# EAGLE board OutputIndicator_v1p2 (EAGLE 9.6.1)
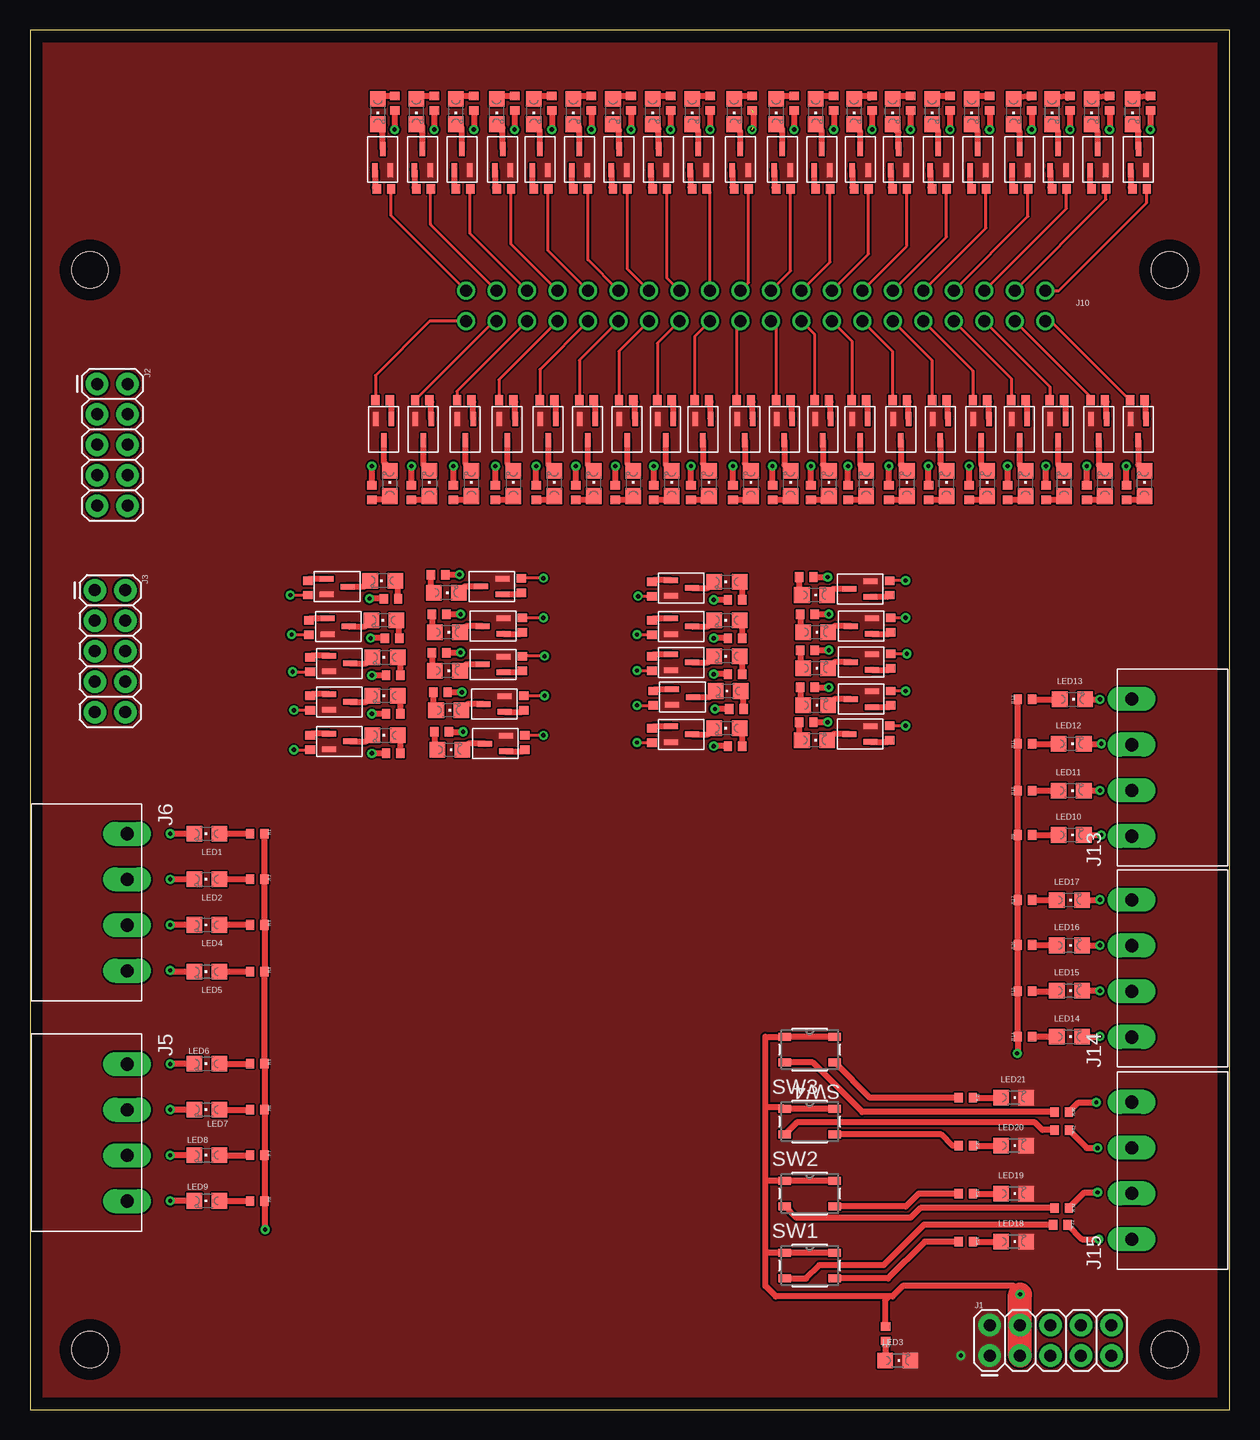
[diagram p6: board, top side]
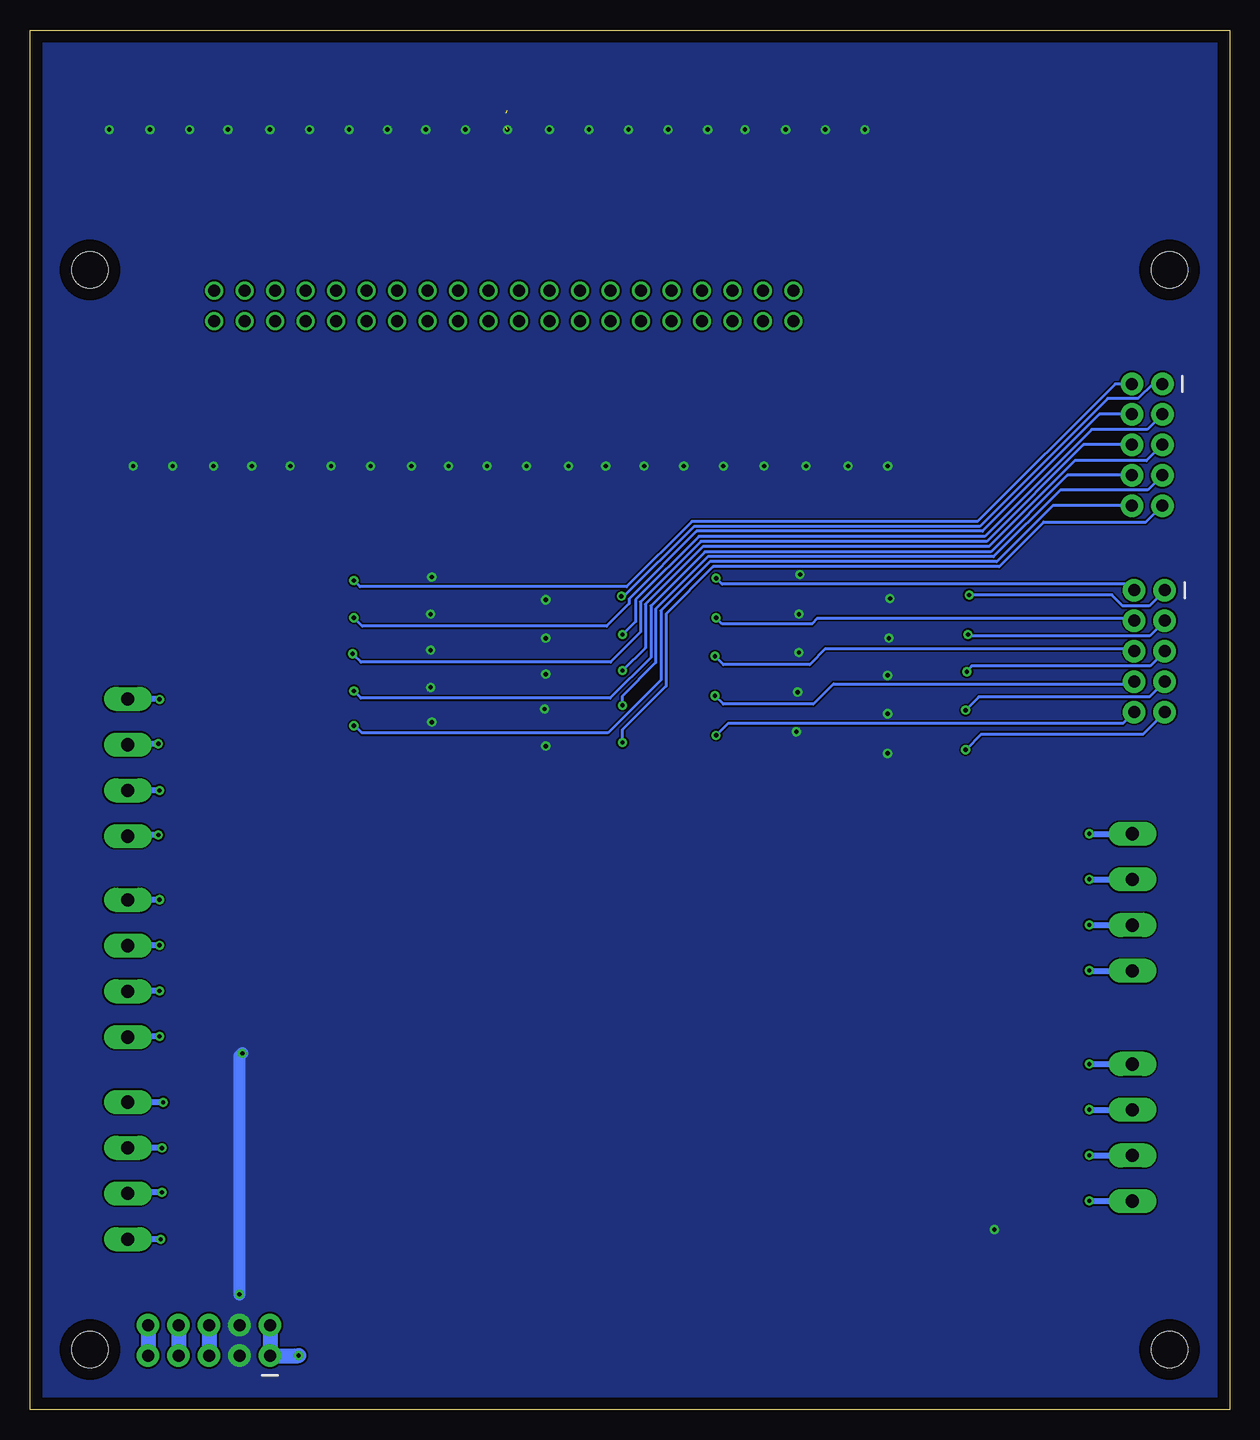
[diagram p7: board, bottom side, seen from below]

Size 100 x 115 mm. Coordinates in mm from the lower left corner, seen from the top.
Outline: 0,0 100,0 100,115 0,115 0,0
Copper layers (1*16): Top 0.035mm / dielectric 1.5mm / Bottom 0.035mm
Design rules "default": minimum track width 6mil, minimum drill 0.35mm, track to track 6mil, track to pad 6mil, pad to pad 6mil, via to via 6mil, smd to smd 6mil, copper to edge 40mil, drill to drill 6mil, minimum pad ring 10mil, minimum via ring 8mil, stop-mask expansion 4mil, vias tented up to drill 0mil, thermal gap 10mil
Holes 3 mm at 5,5 95,5 5,95 95,95

## Footprints (pad centres in the part's own frame; a part is rotated, then mirrored left to right if it is on the bottom)
2X5 = drill 1 pad 1.88: 1 0,0; 2 0,2.54; 3 2.54,0; 4 2.54,2.54; 5 5.08,0; 6 5.08,2.54; 7 7.62,0; 8 7.62,2.54; 9 10.16,0; 10 10.16,2.54
1X4_3.81MM_PITCH = drill 1.1 pad 2 long: P$1 0,0; P$2 3.81,0; P$3 7.62,0; P$4 11.43,0
HEADER_2_X_20_.1_INCH = drill 1: P$1 -24.13,-1.27; P$2 -24.13,1.27; P$3 -21.59,-1.27; P$4 -21.59,1.27; P$5 -19.05,-1.27; P$6 -19.05,1.27; P$7 -16.51,-1.27; P$8 -16.51,1.27; P$9 -13.97,-1.27; P$10 -13.97,1.27; P$11 -11.43,-1.27; P$12 -11.43,1.27; P$13 -8.89,-1.27; P$14 -8.89,1.27; P$15 -6.35,-1.27; P$16 -6.35,1.27; P$17 -3.81,-1.27; P$18 -3.81,1.27; P$19 -1.27,-1.27; P$20 -1.27,1.27; P$21 1.27,-1.27; P$22 1.27,1.27; P$23 3.81,-1.27; P$24 3.81,1.27; P$25 6.35,-1.27; P$26 6.35,1.27; P$27 8.89,-1.27; P$28 8.89,1.27; P$29 11.43,-1.27; P$30 11.43,1.27; P$31 13.97,-1.27; P$32 13.97,1.27; P$33 16.51,-1.27; P$34 16.51,1.27; P$35 19.05,-1.27; P$36 19.05,1.27; P$37 21.59,-1.27; P$38 21.59,1.27; P$39 24.13,-1.27; P$40 24.13,1.27
LED_0805_GREEN = smd 1.3 x 1.3: A 0,-1.05; C 0,1.05
0402 = smd 0.8 x 0.7: P$1 0,0.6; P$2 0,-0.6
PTS810 = smd 1.041 x 0.66: 1 -2.075,1.075; 2 2.075,1.075; 3 -2.075,-1.075; 4 2.075,-1.075
SOT323 = smd 0.457 x 1.168: 1 -0.65,-0.876; 2 0.65,-0.876; 3 0,0.876

## Placement (x,y rotation side)
J1  [2X5]  80,4.5 0 top
J2  [2X5]  5.6,85.5 270 top
J3  [2X5]  5.4,68.3 270 top
J5  [1X4_3.81MM_PITCH]  8.1,28.8 270 top
J6  [1X4_3.81MM_PITCH]  8.1,48 270 top
J10  [HEADER_2_X_20_.1_INCH]  60.5,92 0 top
J13  [1X4_3.81MM_PITCH]  91.85,47.8 90 top
J14  [1X4_3.81MM_PITCH]  91.85,31.05 90 top
J15  [1X4_3.81MM_PITCH]  91.85,14.2 90 top
LED1  LED_0805_GREEN  [LED_0805_GREEN]  14.75,48 90 top
LED2  LED_0805_GREEN  [LED_0805_GREEN]  14.75,44.2 90 top
LED3  LED_0805_GREEN  [LED_0805_GREEN]  72.34,4.09 270 top
LED4  LED_0805_GREEN  [LED_0805_GREEN]  14.75,40.4 90 top
LED5  LED_0805_GREEN  [LED_0805_GREEN]  14.75,36.5 90 top
LED6  LED_0805_GREEN  [LED_0805_GREEN]  14.75,28.82 90 top
LED7  LED_0805_GREEN  [LED_0805_GREEN]  14.75,25 90 top
LED8  LED_0805_GREEN  [LED_0805_GREEN]  14.75,21.2 90 top
LED9  LED_0805_GREEN  [LED_0805_GREEN]  14.75,17.4 90 top
LED10  LED_0805_GREEN  [LED_0805_GREEN]  86.8,47.9 270 top
LED11  LED_0805_GREEN  [LED_0805_GREEN]  86.8,51.6 270 top
LED12  LED_0805_GREEN  [LED_0805_GREEN]  86.8,55.5 270 top
LED13  LED_0805_GREEN  [LED_0805_GREEN]  86.9,59.2 270 top
LED14  LED_0805_GREEN  [LED_0805_GREEN]  86.66,31.07 270 top
LED15  LED_0805_GREEN  [LED_0805_GREEN]  86.66,34.92 270 top
LED16  LED_0805_GREEN  [LED_0805_GREEN]  86.66,38.69 270 top
LED17  LED_0805_GREEN  [LED_0805_GREEN]  86.66,42.47 270 top
LED18  LED_0805_GREEN  [LED_0805_GREEN]  82,14 270 top
LED19  LED_0805_GREEN  [LED_0805_GREEN]  82,18 270 top
LED20  LED_0805_GREEN  [LED_0805_GREEN]  82,22 270 top
LED21  LED_0805_GREEN  [LED_0805_GREEN]  82,26 270 top
LED23  LED_0805_GREEN  [LED_0805_GREEN]  29,108.2 180 top
LED24  LED_0805_GREEN  [LED_0805_GREEN]  32.2,108.2 180 top
LED25  LED_0805_GREEN  [LED_0805_GREEN]  35.5,108.2 180 top
LED26  LED_0805_GREEN  [LED_0805_GREEN]  29.4,69.1 90 top
LED27  LED_0805_GREEN  [LED_0805_GREEN]  38.9,108.2 180 top
LED28  LED_0805_GREEN  [LED_0805_GREEN]  29.5,65.8 90 top
LED29  LED_0805_GREEN  [LED_0805_GREEN]  42,108.2 180 top
LED30  LED_0805_GREEN  [LED_0805_GREEN]  34.7,68.1 270 top
LED31  LED_0805_GREEN  [LED_0805_GREEN]  45.3,108.2 180 top
LED32  LED_0805_GREEN  [LED_0805_GREEN]  29.6,62.7 90 top
LED33  LED_0805_GREEN  [LED_0805_GREEN]  48.6,108.2 180 top
LED35  LED_0805_GREEN  [LED_0805_GREEN]  51.9,108.2 180 top
LED36  LED_0805_GREEN  [LED_0805_GREEN]  29.6,56.2 90 top
LED37  LED_0805_GREEN  [LED_0805_GREEN]  55.2,108.2 180 top
LED38  LED_0805_GREEN  [LED_0805_GREEN]  34.8,64.8 270 top
LED39  LED_0805_GREEN  [LED_0805_GREEN]  58.7,108.2 180 top
LED40  LED_0805_GREEN  [LED_0805_GREEN]  29.6,59.5 90 top
LED41  LED_0805_GREEN  [LED_0805_GREEN]  62.2,108.2 180 top
LED43  LED_0805_GREEN  [LED_0805_GREEN]  65.5,108.2 180 top
LED44  LED_0805_GREEN  [LED_0805_GREEN]  34.8,61.6 270 top
LED45  LED_0805_GREEN  [LED_0805_GREEN]  68.7,108.2 180 top
LED47  LED_0805_GREEN  [LED_0805_GREEN]  71.9,108.2 180 top
LED48  LED_0805_GREEN  [LED_0805_GREEN]  34.9,58.3 270 top
LED49  LED_0805_GREEN  [LED_0805_GREEN]  75.2,108.2 180 top
LED51  LED_0805_GREEN  [LED_0805_GREEN]  78.5,108.2 180 top
LED52  LED_0805_GREEN  [LED_0805_GREEN]  35,55 270 top
LED53  LED_0805_GREEN  [LED_0805_GREEN]  82,108.2 180 top
LED55  LED_0805_GREEN  [LED_0805_GREEN]  85.2,108.2 180 top
LED56  LED_0805_GREEN  [LED_0805_GREEN]  58.1,69 90 top
LED57  LED_0805_GREEN  [LED_0805_GREEN]  88.5,108.2 180 top
LED59  LED_0805_GREEN  [LED_0805_GREEN]  91.9,108.2 180 top
LED60  LED_0805_GREEN  [LED_0805_GREEN]  58.1,65.8 90 top
LED61  LED_0805_GREEN  [LED_0805_GREEN]  30,77.2 0 top
LED63  LED_0805_GREEN  [LED_0805_GREEN]  33.3,77.2 0 top
LED64  LED_0805_GREEN  [LED_0805_GREEN]  58.1,62.8 90 top
LED65  LED_0805_GREEN  [LED_0805_GREEN]  36.8,77.2 0 top
LED67  LED_0805_GREEN  [LED_0805_GREEN]  40.3,77.2 0 top
LED68  LED_0805_GREEN  [LED_0805_GREEN]  58.2,59.9 90 top
LED69  LED_0805_GREEN  [LED_0805_GREEN]  43.7,77.2 0 top
LED71  LED_0805_GREEN  [LED_0805_GREEN]  47,77.2 0 top
LED72  LED_0805_GREEN  [LED_0805_GREEN]  58.1,56.8 90 top
LED73  LED_0805_GREEN  [LED_0805_GREEN]  50.3,77.2 0 top
LED75  LED_0805_GREEN  [LED_0805_GREEN]  53.5,77.2 0 top
LED76  LED_0805_GREEN  [LED_0805_GREEN]  65.4,67.9 270 top
LED77  LED_0805_GREEN  [LED_0805_GREEN]  56.6,77.2 0 top
LED79  LED_0805_GREEN  [LED_0805_GREEN]  60.1,77.2 0 top
LED80  LED_0805_GREEN  [LED_0805_GREEN]  65.5,64.8 270 top
LED81  LED_0805_GREEN  [LED_0805_GREEN]  63.4,77.2 0 top
LED83  LED_0805_GREEN  [LED_0805_GREEN]  66.6,77.2 0 top
LED84  LED_0805_GREEN  [LED_0805_GREEN]  65.5,61.8 270 top
LED85  LED_0805_GREEN  [LED_0805_GREEN]  69.7,77.2 0 top
LED87  LED_0805_GREEN  [LED_0805_GREEN]  73.1,77.2 0 top
LED88  LED_0805_GREEN  [LED_0805_GREEN]  65.5,58.7 270 top
LED89  LED_0805_GREEN  [LED_0805_GREEN]  76.4,77.2 0 top
LED91  LED_0805_GREEN  [LED_0805_GREEN]  79.8,77.2 0 top
LED92  LED_0805_GREEN  [LED_0805_GREEN]  65.4,55.8 270 top
LED93  LED_0805_GREEN  [LED_0805_GREEN]  83,77.2 0 top
LED95  LED_0805_GREEN  [LED_0805_GREEN]  86.2,77.2 0 top
LED97  LED_0805_GREEN  [LED_0805_GREEN]  89.6,77.2 0 top
LED99  LED_0805_GREEN  [LED_0805_GREEN]  92.9,77.2 0 top
R1  470R  [0402]  18.95,48 270 top
R2  470R  [0402]  18.95,44.2 270 top
R3  470R  [0402]  18.95,40.4 270 top
R4  470R  [0402]  18.95,36.5 270 top
R5  470R  [0402]  18.95,28.83 270 top
R6  470R  [0402]  18.95,25 270 top
R7  470R  [0402]  18.95,21.2 270 top
R8  470R  [0402]  18.95,17.38 270 top
R9  470R  [0402]  82.95,47.9 90 top
R10  470R  [0402]  82.95,51.6 90 top
R11  470R  [0402]  82.95,55.5 90 top
R12  470R  [0402]  82.95,59.2 90 top
R13  470R  [0402]  71.32,6.33 180 top
R14  470R  [0402]  82.95,31.1 90 top
R15  470R  [0402]  82.95,34.86 90 top
R16  470R  [0402]  82.95,38.73 90 top
R17  470R  [0402]  82.95,42.48 90 top
R18  470R  [0402]  78,14 270 top
R19  470R  [0402]  78,18 270 top
R20  470R  [0402]  78,22 270 top
R21  470R  [0402]  78,26 270 top
R22  470  [0402]  85.9,15.4 270 top
R23  470R  [0402]  30.4,108.9 0 top
R24  470R  [0402]  33.7,108.9 0 top
R25  470R  [0402]  37,108.9 0 top
R26  470R  [0402]  30.09,67.6 270 top
R27  470R  [0402]  40.4,108.9 0 top
R28  470R  [0402]  30.19,64.3 270 top
R29  470R  [0402]  43.5,108.9 0 top
R30  470R  [0402]  34.01,69.6 90 top
R31  470R  [0402]  46.8,108.9 0 top
R32  470R  [0402]  30.29,61.2 270 top
R33  470R  [0402]  50.1,108.9 0 top
R34  470  [0402]  86,16.8 270 top
R35  470R  [0402]  53.4,108.9 0 top
R36  470R  [0402]  30.29,54.7 270 top
R37  470R  [0402]  56.7,108.9 0 top
R38  470R  [0402]  34.11,66.3 90 top
R39  470R  [0402]  60.2,108.9 0 top
R40  470R  [0402]  30.29,58 270 top
R41  470R  [0402]  63.7,108.9 0 top
R42  470  [0402]  86,23.3 270 top
R43  470R  [0402]  67,108.9 0 top
R44  470R  [0402]  34.11,63.1 90 top
R45  470R  [0402]  70.2,108.9 0 top
R46  470  [0402]  86,24.8 270 top
R47  470R  [0402]  73.4,108.9 0 top
R48  470R  [0402]  34.21,59.8 90 top
R49  470R  [0402]  76.7,108.89 0 top
R51  470R  [0402]  80,108.9 0 top
R52  470R  [0402]  34.31,56.5 90 top
R53  470R  [0402]  83.5,108.9 0 top
R55  470R  [0402]  86.7,108.9 0 top
R56  470R  [0402]  58.79,67.5 270 top
R57  470R  [0402]  90,108.9 0 top
R59  470R  [0402]  93.4,108.9 0 top
R60  470R  [0402]  58.79,64.3 270 top
R61  470R  [0402]  28.5,76.45 180 top
R63  470R  [0402]  31.8,76.45 180 top
R64  470R  [0402]  58.79,61.3 270 top
R65  470R  [0402]  35.3,76.45 180 top
R67  470R  [0402]  38.8,76.45 180 top
R68  470R  [0402]  58.89,58.4 270 top
R69  470R  [0402]  42.2,76.45 180 top
R71  470R  [0402]  45.5,76.45 180 top
R72  470R  [0402]  58.79,55.3 270 top
R73  470R  [0402]  48.8,76.45 180 top
R75  470R  [0402]  52,76.45 180 top
R76  470R  [0402]  64.71,69.4 90 top
R77  470R  [0402]  55.1,76.45 180 top
R79  470R  [0402]  58.6,76.45 180 top
R80  470R  [0402]  64.81,66.3 90 top
R81  470R  [0402]  61.9,76.45 180 top
R83  470R  [0402]  65.1,76.45 180 top
R84  470R  [0402]  64.81,63.3 90 top
R85  470R  [0402]  68.2,76.45 180 top
R87  470R  [0402]  71.6,76.45 180 top
R88  470R  [0402]  64.81,60.2 90 top
R89  470R  [0402]  74.9,76.45 180 top
R91  470R  [0402]  78.3,76.45 180 top
R92  470R  [0402]  64.71,57.3 90 top
R93  470R  [0402]  81.5,76.45 180 top
R95  470R  [0402]  84.7,76.45 180 top
R97  470R  [0402]  88.1,76.45 180 top
R99  470R  [0402]  91.4,76.45 180 top
RYS1  1K  [0402]  29.5,101.75 270 top
RYS2  1K  [0402]  32.8,101.75 270 top
RYS3  1K  [0402]  36.1,101.75 270 top
RYS4  1K  [0402]  23.15,68.5 180 top
RYS5  1K  [0402]  39.5,101.75 270 top
RYS6  1K  [0402]  23.25,65.2 180 top
RYS7  1K  [0402]  42.6,101.75 270 top
RYS9  1K  [0402]  40.95,68.7 0 top
RYS10  1K  [0402]  45.9,101.75 270 top
RYS11  1K  [0402]  23.35,62.1 180 top
RYS12  1K  [0402]  49.2,101.75 270 top
RYS14  1K  [0402]  52.5,101.75 270 top
RYS15  1K  [0402]  23.35,55.6 180 top
RYS16  1K  [0402]  55.8,101.75 270 top
RYS17  1K  [0402]  41.05,65.4 0 top
RYS18  1K  [0402]  59.3,101.75 270 top
RYS19  1K  [0402]  23.35,58.9 180 top
RYS20  1K  [0402]  62.8,101.75 270 top
RYS22  1K  [0402]  66.1,101.75 270 top
RYS23  1K  [0402]  41.05,62.2 0 top
RYS24  1K  [0402]  69.3,101.75 270 top
RYS26  1K  [0402]  72.5,101.75 270 top
RYS27  1K  [0402]  41.15,58.9 0 top
RYS28  1K  [0402]  75.8,101.75 270 top
RYS30  1K  [0402]  79.1,101.75 270 top
RYS31  1K  [0402]  41.25,55.6 0 top
RYS32  1K  [0402]  82.6,101.75 270 top
RYS34  1K  [0402]  85.8,101.75 270 top
RYS35  1K  [0402]  51.85,68.4 180 top
RYS36  1K  [0402]  89.1,101.75 270 top
RYS38  1K  [0402]  92.5,101.75 270 top
RYS39  1K  [0402]  51.85,65.2 180 top
RYS40  1K  [0402]  29.4,84.15 90 top
RYS42  1K  [0402]  32.7,84.15 90 top
RYS43  1K  [0402]  51.85,62.2 180 top
RYS44  1K  [0402]  36.2,84.15 90 top
RYS46  1K  [0402]  39.7,84.15 90 top
RYS47  1K  [0402]  51.95,59.3 180 top
RYS48  1K  [0402]  43.1,84.15 90 top
RYS50  1K  [0402]  46.4,84.15 90 top
RYS51  1K  [0402]  51.85,56.2 180 top
RYS52  1K  [0402]  49.7,84.15 90 top
RYS54  1K  [0402]  52.9,84.15 90 top
RYS55  1K  [0402]  71.65,68.5 0 top
RYS56  1K  [0402]  56,84.15 90 top
RYS58  1K  [0402]  59.5,84.15 90 top
RYS59  1K  [0402]  71.75,65.4 0 top
RYS60  1K  [0402]  62.8,84.15 90 top
RYS62  1K  [0402]  66,84.15 90 top
RYS63  1K  [0402]  71.75,62.4 0 top
RYS64  1K  [0402]  69.1,84.15 90 top
RYS66  1K  [0402]  72.5,84.15 90 top
RYS67  1K  [0402]  71.75,59.3 0 top
RYS68  1K  [0402]  75.8,84.15 90 top
RYS70  1K  [0402]  79.2,84.15 90 top
RYS71  1K  [0402]  71.65,56.4 0 top
RYS72  1K  [0402]  82.4,84.15 90 top
RYS74  1K  [0402]  85.6,84.15 90 top
RYS76  1K  [0402]  89,84.15 90 top
RYS78  1K  [0402]  92.3,84.15 90 top
SW1  PTS810SJG250SMTRLFS  [PTS810]  65,12 0 top
SW2  PTS810SJG250SMTRLFS  [PTS810]  65,18 0 top
SW3  PTS810SJG250SMTRLFS  [PTS810]  65,24 0 top
SW4  PTS810SJG250SMTRLFS  [PTS810]  65,30 0 top
U1  [SOT323]  29.41,104.2 0 top
U2  [SOT323]  32.71,104.2 0 top
U3  [SOT323]  36.01,104.2 0 top
U4  [SOT323]  25.6,68.59 270 top
U5  [SOT323]  39.41,104.2 0 top
U6  [SOT323]  25.7,65.29 270 top
U7  [SOT323]  42.51,104.2 0 top
U8  [SOT323]  38.5,68.61 90 top
U9  [SOT323]  45.81,104.2 0 top
U10  [SOT323]  25.8,62.19 270 top
U11  [SOT323]  49.11,104.2 0 top
U13  [SOT323]  52.41,104.2 0 top
U14  [SOT323]  25.8,55.69 270 top
U15  [SOT323]  55.71,104.2 0 top
U16  [SOT323]  38.6,65.31 90 top
U17  [SOT323]  59.21,104.2 0 top
U18  [SOT323]  25.8,58.99 270 top
U20  [SOT323]  62.71,104.2 0 top
U22  [SOT323]  66.01,104.2 0 top
U23  [SOT323]  38.6,62.11 90 top
U24  [SOT323]  69.21,104.2 0 top
U26  [SOT323]  72.41,104.2 0 top
U27  [SOT323]  38.7,58.81 90 top
U28  [SOT323]  75.71,104.2 0 top
U30  [SOT323]  79.01,104.2 0 top
U31  [SOT323]  38.8,55.51 90 top
U32  [SOT323]  82.51,104.2 0 top
U34  [SOT323]  85.71,104.2 0 top
U35  [SOT323]  54.3,68.49 270 top
U36  [SOT323]  89.01,104.2 0 top
U38  [SOT323]  92.41,104.2 0 top
U39  [SOT323]  54.3,65.29 270 top
U40  [SOT323]  29.49,81.7 180 top
U42  [SOT323]  32.79,81.7 180 top
U43  [SOT323]  54.3,62.29 270 top
U44  [SOT323]  36.29,81.7 180 top
U46  [SOT323]  39.79,81.7 180 top
U47  [SOT323]  54.4,59.39 270 top
U48  [SOT323]  43.19,81.7 180 top
U50  [SOT323]  46.49,81.7 180 top
U51  [SOT323]  54.3,56.29 270 top
U52  [SOT323]  49.79,81.7 180 top
U54  [SOT323]  52.99,81.7 180 top
U55  [SOT323]  69.2,68.41 90 top
U56  [SOT323]  56.09,81.7 180 top
U58  [SOT323]  59.59,81.7 180 top
U59  [SOT323]  69.3,65.31 90 top
U60  [SOT323]  62.89,81.7 180 top
U62  [SOT323]  66.09,81.7 180 top
U63  [SOT323]  69.3,62.31 90 top
U64  [SOT323]  69.19,81.7 180 top
U66  [SOT323]  72.59,81.7 180 top
U67  [SOT323]  69.3,59.21 90 top
U68  [SOT323]  75.89,81.7 180 top
U70  [SOT323]  79.29,81.7 180 top
U71  [SOT323]  69.2,56.31 90 top
U72  [SOT323]  82.49,81.7 180 top
U74  [SOT323]  85.69,81.7 180 top
U76  [SOT323]  89.09,81.7 180 top
U78  [SOT323]  92.39,81.7 180 top

## Tracks (layer width: path | path; a pad name or v marks a point on that pad's centre or on a via)
GND  (via drill 0.35)
  Bottom 1.27: J1.2 J1.1 v77.6,4.5
  pour Top (no thermals): 0,0 0,115 100,115 100,0
GNDE
  Bottom 1.27: J1.10 J1.9
IIC_1_SCL
  Top 0.254: J10.P$5 35.6,84.88 RYS44.P$1
IIC_1_SDA
  Top 0.254: J10.P$6 36.7,98.02 RYS3.P$1
INT_MI_01
  Top 0.254: J10.P$39 85.12,90.73 RYS78.P$1
INT_MI_02
  Top 0.254: J10.P$40 85.77,93.27 93.1,100.6 RYS38.P$1
INT_MI_03
  Top 0.254: J10.P$9 42.5,86.7 RYS48.P$1
INT_MI_04
  Top 0.254: J10.P$10 43.2,96.6 RYS7.P$1
INT_MI_05
  Top 0.254: J10.P$1 33.33,90.73 28.8,86.2 RYS40.P$1
J2_1  (via drill 0.35)
  Top 0.254: v50.7,67.8 RYS35.P$1
  Bottom 0.254: J2.1 6.42,85.5 7.63,84.28 10.16,84.28 20.82,73.62 44.64,73.62 50.46,67.8 v50.7,67.8
J2_2  (via drill 0.35)
  Top 0.254: v73,69.1 RYS55.P$1
  Bottom 0.254: J2.2 9.54,85.5 21.01,74.03 44.83,74.03 50.26,68.6 72.5,68.6 v73,69.1
J2_3  (via drill 0.35)
  Top 0.254: v50.6,64.6 RYS39.P$1
  Bottom 0.254: J2.3 6.86,81.7 11.5,81.7 20.41,72.79 44.25,72.79 49.52,67.52 49.52,65.68 v50.6,64.6
J2_4  (via drill 0.35)
  Top 0.254: v73,66 RYS59.P$1
  Bottom 0.254: J2.4 10.85,82.96 20.6,73.21 44.42,73.21 50.05,67.58 50.05,67.18 51.93,65.3 72.3,65.3 v73,66
J2_5  (via drill 0.35)
  Top 0.254: v50.6,61.6 RYS43.P$1
  Bottom 0.254: J2.5 6.92,79.1 12.9,79.1 20.06,71.94 43.89,71.94 48.7,67.13 48.7,63.49 v50.59,61.6 v50.6,61.6
J2_6  (via drill 0.35)
  Top 0.254: v73.1,63 RYS63.P$1
  Bottom 0.254: J2.6 12.18,80.42 20.23,72.37 44.07,72.37 49.11,67.33 49.11,64.79 51.6,62.3 72.4,62.3 v73.1,63
J2_7  (via drill 0.35)
  Top 0.254: v50.6,58.7 RYS47.P$1
  Bottom 0.254: J2.7 6.82,76.66 14.1,76.66 19.67,71.09 43.5,71.09 47.84,66.75 47.84,62.26 50.6,59.5 v50.6,58.7
J2_8  (via drill 0.35)
  Top 0.254: v73,59.9 RYS67.P$1
  Bottom 0.254: J2.8 13.52,77.88 19.9,71.5 43.74,71.5 48.25,66.99 48.25,62.68 51.63,59.3 72.4,59.3 v73,59.9
J2_9  (via drill 0.35)
  Top 0.254: v50.6,55.6 RYS51.P$1
  Bottom 0.254: J2.9 6.96,73.98 15.48,73.98 19.2,70.26 43.04,70.26 46.97,66.33 46.97,60.3 50.6,56.67 v50.6,55.6
J2_10  (via drill 0.35)
  Top 0.254: v73,57 RYS71.P$1
  Bottom 0.254: v73,57 72.9,57 72.3,56.4 51.82,56.4 47.41,60.81 47.41,66.59 43.32,70.68 19.4,70.68 14.74,75.34 J2.10
J3_1  (via drill 0.35)
  Top 0.254: v21.7,67.9 RYS4.P$1
  Bottom 0.254: J3.1 6.7,67 8.9,67 9.8,67.9 v21.7,67.9
J3_2  (via drill 0.35)
  Top 0.254: v42.8,69.3 RYS9.P$1
  Bottom 0.254: J3.2 8.44,68.8 42.3,68.8 v42.8,69.3
J3_3  (via drill 0.35)
  Top 0.254: v21.8,64.6 RYS6.P$1
  Bottom 0.254: J3.3 6.66,64.5 21.7,64.5 v21.8,64.6
J3_4  (via drill 0.35)
  Top 0.254: v42.8,66 RYS17.P$1
  Bottom 0.254: J3.4 8.14,65.96 34.34,65.96 34.8,65.5 42.3,65.5 v42.8,66
J3_5  (via drill 0.35)
  Top 0.254: v21.9,61.5 RYS11.P$1
  Bottom 0.254: J3.5 6.62,62 21.5,62 21.9,61.6 v21.9,61.5
J3_6  (via drill 0.35)
  Top 0.254: v42.9,62.8 RYS23.P$1
  Bottom 0.254: J3.6 8.14,63.42 33.68,63.42 35,62.1 42.2,62.1 v42.9,62.8
J3_7  (via drill 0.35)
  Top 0.254: v22,58.3 RYS19.P$1
  Bottom 0.254: J3.7 6.68,59.4 20.9,59.4 v22,58.3
J3_8  (via drill 0.35)
  Top 0.254: v42.9,59.5 RYS27.P$1
  Bottom 0.254: J3.8 8.14,60.48 33.02,60.48 34.7,58.8 42.2,58.8 v42.9,59.5
J3_9  (via drill 0.35)
  Top 0.254: v22,55 RYS15.P$1
  Bottom 0.254: J3.9 5.4,58.1 7.2,56.3 20.7,56.3 v22,55
J3_10  (via drill 0.35)
  Top 0.254: v42.8,56.2 RYS31.P$1
  Bottom 0.254: J3.10 8.88,57.2 41.8,57.2 v42.8,56.2
N$1  (via drill 0.35)
  Top 0.508: 13.68,28.8 LED6.C 11.72,28.82 v11.7,28.8
  Bottom 0.508: v11.7,28.8 J5.P$1
N$2  (via drill 0.35)
  Top 0.508: LED7.C v11.7,25
  Bottom 0.508: v11.7,25 v11.69,24.99 J5.P$2
N$3
  Top 0.508: R13.P$1 71.32,4.12 LED3.A
N$4  (via drill 0.35)
  Top 0.508: 13.68,21.18 LED8.C v11.7,21.2
  Bottom 0.508: v11.7,21.2 8.12,21.2 J5.P$3
N$5  (via drill 0.35)
  Top 0.508: 13.67,17.37 LED9.C v11.7,17.4
  Bottom 0.508: v11.7,17.4 8.13,17.4 J5.P$4
N$6
  Top 0.508: LED9.A 18.33,17.4 R8.P$2
N$7
  Top 0.508: LED8.A R7.P$2
N$8
  Top 0.508: LED7.A R6.P$2
N$9
  Top 0.508: LED6.A R5.P$2
N$10  (via drill 0.35)
  Top 0.508: LED1.C v11.7,48
  Bottom 0.508: v11.7,48 J6.P$1
N$11  (via drill 0.35)
  Top 0.508: LED2.C v11.7,44.2
  Bottom 0.508: v11.7,44.2 J6.P$2
N$12  (via drill 0.35)
  Top 0.508: LED4.C v11.7,40.4
  Bottom 0.508: v11.7,40.4 8.12,40.4 J6.P$3
N$13  (via drill 0.35)
  Top 0.508: 13.63,36.57 LED5.C 11.8,36.5 v11.7,36.6
  Bottom 0.508: v11.7,36.6 11.67,36.57 J6.P$4
N$14
  Top 0.508: R4.P$2 LED5.A
N$15
  Top 0.508: R2.P$2 LED2.A
N$16
  Top 0.508: R1.P$2 LED1.A
N$17
  Top 0.508: R3.P$2 LED4.A
N$18  (via drill 0.35)
  Top 0.508: LED10.C v89.3,47.9
  Bottom 0.508: v89.3,47.9 91.75,47.9 J13.P$1
N$19  (via drill 0.35)
  Top 0.508: LED11.C v89.2,51.6
  Bottom 0.508: v89.2,51.6 J13.P$2
N$20  (via drill 0.35)
  Top 0.508: LED12.C v89.3,55.5
  Bottom 0.508: v89.3,55.5 91.77,55.5 J13.P$3
N$21  (via drill 0.35)
  Top 0.508: 87.98,59.23 LED13.C v89.2,59.2
  Bottom 0.508: v89.2,59.2 89.23,59.23 J13.P$4
N$22
  Top 0.508: R12.P$2 LED13.A
N$23
  Top 0.508: R10.P$2 LED11.A
N$24
  Top 0.508: R9.P$2 LED10.A
N$25
  Top 0.508: R11.P$2 LED12.A
N$26  (via drill 0.35)
  Top 0.508: LED14.C 89.17,31.07 v89.2,31.1
  Bottom 0.508: v89.2,31.1 91.8,31.1 J14.P$1
N$27  (via drill 0.35)
  Top 0.508: LED15.C 89.18,34.92 v89.2,34.9
  Bottom 0.508: v89.2,34.9 91.81,34.9 J14.P$2
N$28  (via drill 0.35)
  Top 0.508: LED16.C v89.19,38.69 v89.2,38.7
  Bottom 0.508: v89.2,38.7 91.82,38.7 J14.P$3
N$29  (via drill 0.35)
  Top 0.508: LED17.C 89.17,42.47 v89.2,42.5
  Bottom 0.508: v89.2,42.5 91.83,42.5 J14.P$4
N$30
  Top 0.508: R17.P$2 85.59,42.48 LED17.A
N$31
  Top 0.508: R15.P$2 85.55,34.86 LED15.A
N$32
  Top 0.508: R14.P$2 85.58,31.1 LED14.A
N$33
  Top 0.508: R16.P$2 85.56,38.73 LED16.A
N$34  (via drill 0.35)
  Top 0.508: R22.P$1 87.7,14.2 v89.1,14.2
  Bottom 0.508: v89.1,14.2 J15.P$1
N$35  (via drill 0.35)
  Top 0.508: R34.P$1 87.9,18.1 v89,18.1
  Bottom 0.508: v89,18.1 91.76,18.1 J15.P$2
N$36  (via drill 0.35)
  Top 0.508: R42.P$1 88.1,21.8 v89,21.8
  Bottom 0.508: v89,21.8 91.83,21.8 J15.P$3
N$37  (via drill 0.35)
  Top 0.508: R46.P$1 87.4,25.6 v88.9,25.6
  Bottom 0.254: v88.9,25.6 88.93,25.63
  Bottom 0.508: v88.9,25.6 91.82,25.6 J15.P$4
N$38
  Top 0.508: R18.P$1 LED18.A
N$39
  Top 0.508: R19.P$1 LED19.A
N$40
  Top 0.508: R20.P$1 LED20.A
N$41
  Top 0.508: R21.P$1 LED21.A
N$42
  Top 0.254: 67.1,28.93 SW4.4
  Top 0.508: R21.P$2 70.03,26 67.1,28.93
N$43
  Top 0.508: R20.P$2 76.9,22 75.97,22.93 SW3.4
N$44
  Top 0.508: R19.P$2 74.08,18 73,16.93 SW2.4
N$45
  Top 0.254: 28.76,101.71 RYS1.P$2
  Top 0.508: U1.1 28.76,101.89 RYS1.P$2
N$46
  Top 0.152: R23.P$1 30.16,109.65
  Top 0.508: R23.P$1 29.44,109.5 LED23.A
N$47
  Top 0.254: LED23.C 28.98,107.38 28.98,107.47
  Top 0.508: U1.3 29.41,107.04 28.98,107.47
N$48
  Top 0.254: 32.06,101.71 RYS2.P$2
  Top 0.508: U2.1 32.06,101.89 RYS2.P$2
N$49
  Top 0.152: R24.P$1 33.46,109.55
  Top 0.508: R24.P$1 32.44,109.5 LED24.A
N$50
  Top 0.254: 32.27,107.38 LED24.C
  Top 0.508: U2.3 32.71,106.94 32.27,107.38
N$51
  Top 0.254: 35.36,101.71 RYS3.P$2
  Top 0.508: U3.1 35.36,101.89 RYS3.P$2
N$52
  Top 0.152: R25.P$1 36.76,109.45
  Top 0.508: R25.P$1 35.74,109.5 LED25.A
N$53
  Top 0.254: 35.58,107.28 LED25.C
  Top 0.508: U3.3 36.01,106.84 35.58,107.28
N$54
  Top 0.254: 23.11,69.24 RYS4.P$2
  Top 0.508: U4.1 23.29,69.24 RYS4.P$2
N$55
  Top 0.152: R26.P$1 30.45,67.84
  Top 0.508: R26.P$1 30.69,68.86 LED26.A
N$56
  Top 0.254: 28.27,69.03 LED26.C
  Top 0.508: U4.3 27.84,68.59 28.27,69.03
N$57
  Top 0.254: 38.76,101.71 RYS5.P$2
  Top 0.508: U5.1 38.76,101.89 RYS5.P$2
N$58
  Top 0.152: R27.P$1 40.16,109.45
  Top 0.508: R27.P$1 39.14,109.5 LED27.A
N$59
  Top 0.254: 38.98,107.28 LED27.C
  Top 0.508: U5.3 39.41,106.84 38.98,107.28
N$60
  Top 0.254: 23.21,65.94 RYS6.P$2
  Top 0.508: U6.1 23.39,65.94 RYS6.P$2
N$61
  Top 0.152: R28.P$1 30.55,64.54
  Top 0.508: R28.P$1 30.79,65.56 LED28.A
N$62
  Top 0.254: 28.38,65.72 LED28.C
  Top 0.508: U6.3 27.94,65.29 28.38,65.72
N$63
  Top 0.254: 41.86,101.71 RYS7.P$2
  Top 0.508: U7.1 41.86,101.89 RYS7.P$2
N$64
  Top 0.152: R29.P$1 43.26,109.25
  Top 0.508: R29.P$1 42.24,109.5 LED29.A
N$65
  Top 0.254: 42.08,107.08 LED29.C
  Top 0.508: U7.3 42.51,106.64 42.08,107.08
N$66
  Top 0.254: 40.99,67.96 RYS9.P$2
  Top 0.508: U8.1 40.81,67.96 RYS9.P$2
N$67
  Top 0.152: R30.P$1 33.65,69.36
  Top 0.508: R30.P$1 33.41,68.34 LED30.A
N$68
  Top 0.254: 35.83,68.17 LED30.C
  Top 0.508: U8.3 36.26,68.61 35.83,68.17
N$69
  Top 0.254: 45.16,101.71 RYS10.P$2
  Top 0.508: U9.1 45.16,101.89 RYS10.P$2
N$70
  Top 0.152: R31.P$1 46.56,109.45
  Top 0.508: R31.P$1 45.54,109.5 LED31.A
N$71
  Top 0.254: 45.38,107.28 LED31.C
  Top 0.508: U9.3 45.81,106.84 45.38,107.28
N$72
  Top 0.254: 23.31,62.84 RYS11.P$2
  Top 0.508: U10.1 23.49,62.84 RYS11.P$2
N$73
  Top 0.152: R32.P$1 30.65,61.44
  Top 0.508: R32.P$1 30.89,62.46 LED32.A
N$74
  Top 0.254: 28.48,62.62 LED32.C
  Top 0.508: U10.3 28.04,62.19 28.48,62.62
N$75
  Top 0.254: 48.46,101.71 RYS12.P$2
  Top 0.508: U11.1 48.46,101.89 RYS12.P$2
N$76
  Top 0.152: R33.P$1 49.86,109.25
  Top 0.508: R33.P$1 48.84,109.5 LED33.A
N$77
  Top 0.254: 48.67,107.08 LED33.C
  Top 0.508: U11.3 49.11,106.64 48.67,107.08
N$78
  Top 0.508: SW1.4 71.53,10.93 74.6,14 R18.P$2
N$79
  Top 0.508: R22.P$2 74.53,15.4 71.16,12.03 65.8,12.03 64.7,10.93 SW1.3
N$80
  Top 0.508: R34.P$2 74.21,16.8 73.4,15.99 63.86,15.99 SW2.3
N$81
  Top 0.254: 51.76,101.71 RYS14.P$2
  Top 0.508: U13.1 51.76,101.89 RYS14.P$2
N$82
  Top 0.152: R35.P$1 53.16,109.35
  Top 0.508: R35.P$1 52.14,109.5 LED35.A
N$83
  Top 0.254: 51.98,107.17 LED35.C
  Top 0.508: U13.3 52.41,106.74 51.98,107.17
N$84
  Top 0.254: 23.31,56.34 RYS15.P$2
  Top 0.508: U14.1 23.49,56.34 RYS15.P$2
N$85
  Top 0.152: R36.P$1 30.65,54.94
  Top 0.508: R36.P$1 30.89,55.96 LED36.A
N$86
  Top 0.254: 28.48,56.12 LED36.C
  Top 0.508: U14.3 28.04,55.69 28.48,56.12
N$87
  Top 0.254: 55.06,101.71 RYS16.P$2
  Top 0.508: U15.1 55.06,101.89 RYS16.P$2
N$88
  Top 0.152: R37.P$1 56.46,109.25
  Top 0.508: R37.P$1 55.44,109.5 LED37.A
N$89
  Top 0.254: 55.27,107.08 LED37.C
  Top 0.508: U15.3 55.71,106.64 55.27,107.08
N$90
  Top 0.254: 41.09,64.66 RYS17.P$2
  Top 0.508: U16.1 40.91,64.66 RYS17.P$2
N$91
  Top 0.152: R38.P$1 33.75,66.06
  Top 0.508: R38.P$1 33.51,65.04 LED38.A
N$92
  Top 0.254: 35.92,64.88 LED38.C
  Top 0.508: U16.3 36.36,65.31 35.92,64.88
N$93
  Top 0.254: 58.56,101.71 RYS18.P$2
  Top 0.508: U17.1 58.56,101.89 RYS18.P$2
N$94
  Top 0.508: R39.P$1 59.96,109.5 58.94,109.5 LED39.A
N$95
  Top 0.254: 58.77,106.97 LED39.C
  Top 0.508: U17.3 59.21,106.54 58.77,106.97
N$96
  Top 0.254: 23.31,59.64 RYS19.P$2
  Top 0.508: U18.1 23.49,59.64 RYS19.P$2
N$97
  Top 0.152: R40.P$1 30.65,58.24
  Top 0.508: R40.P$1 30.89,59.26 LED40.A
N$98
  Top 0.254: 28.48,59.42 LED40.C
  Top 0.508: U18.3 28.04,58.99 28.48,59.42
N$99
  Top 0.254: 62.06,101.71 RYS20.P$2
  Top 0.508: U20.1 62.06,101.89 RYS20.P$2
N$100
  Top 0.152: R41.P$1 63.46,109.35
  Top 0.508: R41.P$1 62.44,109.5 LED41.A
N$101
  Top 0.254: 62.27,107.17 LED41.C
  Top 0.508: U20.3 62.71,106.74 62.27,107.17
N$102
  Top 0.508: R42.P$2 84.4,23.3 83.78,23.93 63.92,23.93 SW3.3
N$103
  Top 0.508: R46.P$2 69.38,24.8 65.25,28.93 SW4.3
N$105
  Top 0.254: 65.36,101.71 RYS22.P$2
  Top 0.508: U22.1 65.36,101.89 RYS22.P$2
N$106
  Top 0.152: R43.P$1 66.76,109.25
  Top 0.508: R43.P$1 65.74,109.5 LED43.A
N$107
  Top 0.254: 65.58,107.08 LED43.C
  Top 0.508: U22.3 66.01,106.64 65.58,107.08
N$108
  Top 0.254: 41.09,61.46 RYS23.P$2
  Top 0.508: U23.1 40.91,61.46 RYS23.P$2
N$109
  Top 0.152: R44.P$1 33.75,62.86
  Top 0.508: R44.P$1 33.51,61.84 LED44.A
N$110
  Top 0.254: 35.92,61.67 LED44.C
  Top 0.508: U23.3 36.36,62.11 35.92,61.67
N$111
  Top 0.254: 68.56,101.71 RYS24.P$2
  Top 0.508: U24.1 68.56,101.89 RYS24.P$2
N$112
  Top 0.152: R45.P$1 69.96,109.15
  Top 0.508: R45.P$1 68.94,109.5 LED45.A
N$113
  Top 0.254: 68.78,106.97 LED45.C
  Top 0.508: U24.3 69.21,106.54 68.78,106.97
N$117
  Top 0.254: 71.76,101.71 RYS26.P$2
  Top 0.508: U26.1 71.76,101.89 RYS26.P$2
N$118
  Top 0.508: R47.P$1 73.16,109.5 72.14,109.5 LED47.A
N$119
  Top 0.254: 71.97,106.88 LED47.C
  Top 0.508: U26.3 72.41,106.44 71.97,106.88
N$120
  Top 0.254: 41.19,58.16 RYS27.P$2
  Top 0.508: U27.1 41.01,58.16 RYS27.P$2
N$121
  Top 0.152: R48.P$1 33.85,59.56
  Top 0.508: R48.P$1 33.61,58.54 LED48.A
N$122
  Top 0.254: 36.02,58.38 LED48.C
  Top 0.508: U27.3 36.46,58.81 36.02,58.38
N$123
  Top 0.254: 75.06,101.71 RYS28.P$2
  Top 0.508: U28.1 75.06,101.89 RYS28.P$2
N$124
  Top 0.152: R49.P$1 76.46,109.25
  Top 0.508: R49.P$1 75.44,109.49 LED49.A
N$125
  Top 0.254: 75.28,107.08 LED49.C
  Top 0.508: U28.3 75.71,106.64 75.28,107.08
N$129
  Top 0.254: 78.36,101.71 RYS30.P$2
  Top 0.508: U30.1 78.36,101.89 RYS30.P$2
N$130
  Top 0.152: R51.P$1 79.76,109.25
  Top 0.508: R51.P$1 78.74,109.5 LED51.A
N$131
  Top 0.254: 78.58,107.08 LED51.C
  Top 0.508: U30.3 79.01,106.64 78.58,107.08
N$132
  Top 0.254: 41.29,54.86 RYS31.P$2
  Top 0.508: U31.1 41.11,54.86 RYS31.P$2
N$133
  Top 0.152: R52.P$1 33.95,56.26
  Top 0.508: R52.P$1 33.71,55.24 LED52.A
N$134
  Top 0.254: 36.12,55.08 LED52.C
  Top 0.508: U31.3 36.56,55.51 36.12,55.08
N$135
  Top 0.254: 81.86,101.71 RYS32.P$2
  Top 0.508: U32.1 81.86,101.89 RYS32.P$2
N$136
  Top 0.152: R53.P$1 83.26,109.15
  Top 0.508: R53.P$1 82.24,109.39 LED53.A
N$137
  Top 0.254: 82.08,106.97 LED53.C
  Top 0.508: U32.3 82.51,106.54 82.08,106.97
N$141
  Top 0.254: 85.06,101.71 RYS34.P$2
  Top 0.508: U34.1 85.06,101.89 RYS34.P$2
N$142
  Top 0.152: R55.P$1 86.46,109.15
  Top 0.508: R55.P$1 85.44,109.39 LED55.A
N$143
  Top 0.254: 85.28,106.97 LED55.C
  Top 0.508: U34.3 85.71,106.54 85.28,106.97
N$144
  Top 0.254: 51.81,69.14 RYS35.P$2
  Top 0.508: U35.1 51.99,69.14 RYS35.P$2
N$145
  Top 0.152: R56.P$1 59.15,67.74
  Top 0.508: R56.P$1 59.39,68.76 LED56.A
N$146
  Top 0.254: 56.98,68.92 LED56.C
  Top 0.508: U35.3 56.54,68.49 56.98,68.92
N$147
  Top 0.254: 88.36,101.71 RYS36.P$2
  Top 0.508: U36.1 88.36,101.89 RYS36.P$2
N$148
  Top 0.152: R57.P$1 89.76,109.15
  Top 0.508: R57.P$1 88.74,109.39 LED57.A
N$149
  Top 0.254: 88.58,106.97 LED57.C
  Top 0.508: U36.3 89.01,106.54 88.58,106.97
N$153
  Top 0.254: 91.76,101.71 RYS38.P$2
  Top 0.508: U38.1 91.76,101.89 RYS38.P$2
N$154
  Top 0.152: R59.P$1 93.16,109.15
  Top 0.508: R59.P$1 92.14,109.39 LED59.A
N$155
  Top 0.254: 91.97,106.97 LED59.C
  Top 0.508: U38.3 92.41,106.54 91.97,106.97
N$156
  Top 0.254: 51.81,65.94 RYS39.P$2
  Top 0.508: U39.1 51.99,65.94 RYS39.P$2
N$157
  Top 0.152: R60.P$1 59.15,64.54
  Top 0.508: R60.P$1 59.39,65.56 LED60.A
N$158
  Top 0.254: 56.98,65.72 LED60.C
  Top 0.508: U39.3 56.54,65.29 56.98,65.72
N$159
  Top 0.254: 30.14,84.19 RYS40.P$2
  Top 0.508: U40.1 30.14,84.01 RYS40.P$2
N$160
  Top 0.152: R61.P$1 28.74,76.09
  Top 0.508: LED61.A 29.7,75.85 R61.P$1
N$161
  Top 0.254: LED61.C 30.02,78.28 30.02,78.42
  Top 0.508: U40.3 29.49,78.96 30.02,78.42
N$165
  Top 0.254: 33.44,84.19 RYS42.P$2
  Top 0.508: U42.1 33.44,84.01 RYS42.P$2
N$166
  Top 0.152: R63.P$1 32.04,76.09
  Top 0.508: R63.P$1 33,75.85 LED63.A
N$167
  Top 0.254: 33.23,78.33 LED63.C
  Top 0.508: U42.3 32.79,78.76 33.23,78.33
N$168
  Top 0.254: 51.81,62.94 RYS43.P$2
  Top 0.508: U43.1 51.99,62.94 RYS43.P$2
N$169
  Top 0.152: R64.P$1 59.15,61.54
  Top 0.508: R64.P$1 59.39,62.56 LED64.A
N$170
  Top 0.254: 56.98,62.73 LED64.C
  Top 0.508: U43.3 56.54,62.29 56.98,62.73
N$171
  Top 0.254: 36.94,84.19 RYS44.P$2
  Top 0.508: U44.1 36.94,84.01 RYS44.P$2
N$172
  Top 0.152: R65.P$1 35.54,76.09
  Top 0.508: R65.P$1 36.5,75.85 LED65.A
N$173
  Top 0.254: 36.73,78.42 36.73,78.33 LED65.C
  Top 0.508: U44.3 36.29,78.86 36.73,78.42
N$177
  Top 0.254: 40.44,84.19 RYS46.P$2
  Top 0.508: U46.1 40.44,84.01 RYS46.P$2
N$178
  Top 0.152: R67.P$1 39.04,76.09
  Top 0.508: R67.P$1 40,75.85 LED67.A
N$179
  Top 0.254: 40.23,78.42 40.23,78.33 LED67.C
  Top 0.508: U46.3 39.79,78.86 40.23,78.42
N$180
  Top 0.254: 51.91,60.04 RYS47.P$2
  Top 0.508: U47.1 52.09,60.04 RYS47.P$2
N$181
  Top 0.152: R68.P$1 59.25,58.64
  Top 0.508: R68.P$1 59.49,59.66 LED68.A
N$182
  Top 0.254: 57.08,59.83 LED68.C
  Top 0.508: U47.3 56.64,59.39 57.08,59.83
N$183
  Top 0.254: 43.84,84.19 RYS48.P$2
  Top 0.508: U48.1 43.84,84.01 RYS48.P$2
N$184
  Top 0.152: R69.P$1 42.44,76.09
  Top 0.508: R69.P$1 43.4,75.85 LED69.A
N$185
  Top 0.254: 43.62,78.33 LED69.C
  Top 0.508: U48.3 43.19,78.76 43.62,78.33
N$189
  Top 0.254: 47.14,84.19 RYS50.P$2
  Top 0.508: U50.1 47.14,84.01 RYS50.P$2
N$190
  Top 0.152: R71.P$1 45.74,76.09
  Top 0.508: R71.P$1 46.7,75.85 LED71.A
N$191
  Top 0.254: 46.92,78.33 LED71.C
  Top 0.508: U50.3 46.49,78.76 46.92,78.33
N$192
  Top 0.254: 51.81,56.94 RYS51.P$2
  Top 0.508: U51.1 51.99,56.94 RYS51.P$2
N$193
  Top 0.152: R72.P$1 59.15,55.54
  Top 0.508: R72.P$1 59.39,56.56 LED72.A
N$194
  Top 0.254: 56.98,56.73 LED72.C
  Top 0.508: U51.3 56.54,56.29 56.98,56.73
N$195
  Top 0.254: 50.44,84.19 RYS52.P$2
  Top 0.508: U52.1 50.44,84.01 RYS52.P$2
N$196
  Top 0.152: R73.P$1 49.04,76.09
  Top 0.508: R73.P$1 50,75.85 LED73.A
N$197
  Top 0.254: 50.23,78.42 50.23,78.33 LED73.C
  Top 0.508: U52.3 49.79,78.86 50.23,78.42
N$201
  Top 0.254: 53.64,84.19 RYS54.P$2
  Top 0.508: U54.1 53.64,84.01 RYS54.P$2
N$202
  Top 0.152: R75.P$1 52.24,76.09
  Top 0.508: R75.P$1 53.2,75.85 LED75.A
N$203
  Top 0.254: 53.42,78.33 LED75.C
  Top 0.508: U54.3 52.99,78.76 53.42,78.33
N$204
  Top 0.254: 71.69,67.76 RYS55.P$2
  Top 0.508: U55.1 71.51,67.76 RYS55.P$2
N$205
  Top 0.152: R76.P$1 64.35,69.16
  Top 0.508: R76.P$1 64.11,68.14 LED76.A
N$206
  Top 0.254: 66.53,67.97 LED76.C
  Top 0.508: U55.3 66.96,68.41 66.53,67.97
N$207
  Top 0.254: 56.74,84.19 RYS56.P$2
  Top 0.508: U56.1 56.74,84.01 RYS56.P$2
N$208
  Top 0.152: R77.P$1 55.34,76.09
  Top 0.508: R77.P$1 56.3,75.85 LED77.A
N$209
  Top 0.254: 56.52,78.42 56.52,78.33 LED77.C
  Top 0.508: U56.3 56.09,78.86 56.52,78.42
N$213
  Top 0.254: 60.24,84.19 RYS58.P$2
  Top 0.508: U58.1 60.24,84.01 RYS58.P$2
N$214
  Top 0.152: R79.P$1 58.84,76.09
  Top 0.508: R79.P$1 59.8,75.85 LED79.A
N$215
  Top 0.254: 60.02,78.42 60.02,78.33 LED79.C
  Top 0.508: U58.3 59.59,78.86 60.02,78.42
N$216
  Top 0.254: 71.79,64.66 RYS59.P$2
  Top 0.508: U59.1 71.61,64.66 RYS59.P$2
N$217
  Top 0.152: R80.P$1 64.45,66.06
  Top 0.508: R80.P$1 64.21,65.04 LED80.A
N$218
  Top 0.254: 66.62,64.88 LED80.C
  Top 0.508: U59.3 67.06,65.31 66.62,64.88
N$219
  Top 0.254: 63.54,84.19 RYS60.P$2
  Top 0.508: U60.1 63.54,84.01 RYS60.P$2
N$220
  Top 0.152: R81.P$1 62.14,76.09
  Top 0.508: R81.P$1 63.1,75.85 LED81.A
N$221
  Top 0.254: 63.33,78.33 LED81.C
  Top 0.508: U60.3 62.89,78.76 63.33,78.33
N$225
  Top 0.254: 66.74,84.19 RYS62.P$2
  Top 0.508: U62.1 66.74,84.01 RYS62.P$2
N$226
  Top 0.152: R83.P$1 65.34,76.09
  Top 0.508: R83.P$1 66.3,75.85 LED83.A
N$227
  Top 0.254: 66.53,78.33 LED83.C
  Top 0.508: U62.3 66.09,78.76 66.53,78.33
N$228
  Top 0.254: 71.79,61.66 RYS63.P$2
  Top 0.508: U63.1 71.61,61.66 RYS63.P$2
N$229
  Top 0.152: R84.P$1 64.45,63.06
  Top 0.508: R84.P$1 64.21,62.04 LED84.A
N$230
  Top 0.254: 66.62,61.88 LED84.C
  Top 0.508: U63.3 67.06,62.31 66.62,61.88
N$231
  Top 0.254: 69.84,84.19 RYS64.P$2
  Top 0.508: U64.1 69.84,84.01 RYS64.P$2
N$232
  Top 0.152: R85.P$1 68.44,76.09
  Top 0.508: R85.P$1 69.4,75.85 LED85.A
N$233
  Top 0.254: 69.62,78.33 LED85.C
  Top 0.508: U64.3 69.19,78.76 69.62,78.33
N$237
  Top 0.254: 73.24,84.19 RYS66.P$2
  Top 0.508: U66.1 73.24,84.01 RYS66.P$2
N$238
  Top 0.152: R87.P$1 71.84,76.09
  Top 0.508: R87.P$1 72.8,75.85 LED87.A
N$239
  Top 0.254: 73.03,78.33 LED87.C
  Top 0.508: U66.3 72.59,78.76 73.03,78.33
N$240
  Top 0.254: 71.79,58.56 RYS67.P$2
  Top 0.508: U67.1 71.61,58.56 RYS67.P$2
N$241
  Top 0.152: R88.P$1 64.45,59.96
  Top 0.508: R88.P$1 64.21,58.94 LED88.A
N$242
  Top 0.254: 66.62,58.77 LED88.C
  Top 0.508: U67.3 67.06,59.21 66.62,58.77
N$243
  Top 0.254: 76.54,84.19 RYS68.P$2
  Top 0.508: U68.1 76.54,84.01 RYS68.P$2
N$244
  Top 0.152: R89.P$1 75.14,76.09
  Top 0.508: R89.P$1 76.1,75.85 LED89.A
N$245
  Top 0.254: LED89.C 76.33,78.33 76.33,78.42
  Top 0.508: U68.3 75.89,78.86 76.33,78.42
N$249
  Top 0.254: 79.94,84.19 RYS70.P$2
  Top 0.508: U70.1 79.94,84.01 RYS70.P$2
N$250
  Top 0.152: R91.P$1 78.54,76.09
  Top 0.508: R91.P$1 79.5,75.85 LED91.A
N$251
  Top 0.254: 79.72,78.33 LED91.C
  Top 0.508: U70.3 79.29,78.76 79.72,78.33
N$252
  Top 0.254: 71.69,55.66 RYS71.P$2
  Top 0.508: U71.1 71.51,55.66 RYS71.P$2
N$253
  Top 0.152: R92.P$1 64.35,57.06
  Top 0.508: R92.P$1 64.11,56.04 LED92.A
N$254
  Top 0.254: 66.53,55.88 LED92.C
  Top 0.508: U71.3 66.96,56.31 66.53,55.88
N$255
  Top 0.254: 83.14,84.19 RYS72.P$2
  Top 0.508: U72.1 83.14,84.01 RYS72.P$2
N$256
  Top 0.152: R93.P$1 81.74,76.09
  Top 0.508: R93.P$1 82.7,75.85 LED93.A
N$257
  Top 0.254: 82.92,78.33 LED93.C
  Top 0.508: U72.3 82.49,78.76 82.92,78.33
N$261
  Top 0.254: 86.34,84.19 RYS74.P$2
  Top 0.508: U74.1 86.34,84.01 RYS74.P$2
N$262
  Top 0.152: R95.P$1 84.94,76.09
  Top 0.508: R95.P$1 85.9,75.85 LED95.A
N$263
  Top 0.254: 86.12,78.33 LED95.C
  Top 0.508: U74.3 85.69,78.76 86.12,78.33
N$267
  Top 0.254: 89.74,84.19 RYS76.P$2
  Top 0.508: U76.1 89.74,84.01 RYS76.P$2
N$268
  Top 0.152: R97.P$1 88.34,76.09
  Top 0.508: R97.P$1 89.3,75.85 LED97.A
N$269
  Top 0.254: 89.53,78.33 LED97.C
  Top 0.508: U76.3 89.09,78.76 89.53,78.33
N$273
  Top 0.254: 93.04,84.19 RYS78.P$2
  Top 0.508: U78.1 93.04,84.01 RYS78.P$2
N$274
  Top 0.152: R99.P$1 91.64,76.09
  Top 0.508: R99.P$1 92.6,75.85 LED99.A
N$275
  Top 0.254: 92.83,78.33 LED99.C
  Top 0.508: U78.3 92.39,78.76 92.83,78.33
P1_02
  Top 0.254: J10.P$7 39.1,85.84 RYS46.P$1
P1_03
  Top 0.254: J10.P$8 40.1,97.16 RYS5.P$1
P1_06
  Top 0.254: J10.P$11 45.8,87.46 RYS50.P$1
P1_07
  Top 0.254: J10.P$12 46.5,95.84 RYS10.P$1
P1_11
  Top 0.254: J10.P$38 89.7,100.88 RYS36.P$1
P1_12
  Top 0.254: J10.P$37 88.4,84.42 RYS76.P$1
P1_13
  Top 0.254: J10.P$36 86.4,100.12 RYS34.P$1
P1_14
  Top 0.254: J10.P$35 85,85.28 RYS74.P$1
P1_15
  Top 0.254: J10.P$34 83.2,99.46 RYS32.P$1
P6_00
  Top 0.254: J10.P$13 49.1,88.22 RYS52.P$1
P6_01
  Top 0.254: J10.P$14 49.8,95.08 RYS12.P$1
P6_02
  Top 0.254: J10.P$15 52.3,88.88 RYS54.P$1
P6_03
  Top 0.254: J10.P$16 53.1,94.32 RYS14.P$1
P6_04
  Top 0.254: J10.P$17 55.4,89.44 RYS56.P$1
P6_05
  Top 0.254: J10.P$18 56.69,101.46 RYS16.P$1
P6_06
  Top 0.254: J10.P$19 58.9,90.4 RYS58.P$1
P6_07
  Top 0.254: J10.P$20 59.9,93.94 RYS18.P$1
P6_08
  Top 0.254: J10.P$33 81.8,85.94 RYS72.P$1
P6_09
  Top 0.254: J10.P$32 79.7,98.5 RYS30.P$1
P6_10
  Top 0.254: J10.P$31 78.6,86.6 RYS70.P$1
P6_11
  Top 0.254: J10.P$30 76.4,97.74 RYS28.P$1
P6_12
  Top 0.254: J10.P$29 75.2,87.46 RYS68.P$1
P6_13
  Top 0.254: J10.P$28 73.1,96.98 RYS26.P$1
P6_14
  Top 0.254: J10.P$27 71.9,88.22 RYS66.P$1
P6_15
  Top 0.254: J10.P$26 69.9,96.32 RYS24.P$1
P8_00
  Top 0.254: J10.P$4 33.4,98.78 RYS2.P$1
P8_01
  Top 0.254: J10.P$3 38.68,90.73 RYS42.P$1
P8_02
  Top 0.254: J10.P$2 30.1,99.54 RYS1.P$1
PA_00
  Top 0.254: J10.P$21 62.2,90.3 RYS60.P$1
PA_01
  Top 0.254: J10.P$22 63.4,94.9 RYS20.P$1
PA_08
  Top 0.254: J10.P$25 68.5,89.08 RYS64.P$1
PA_09
  Top 0.254: J10.P$24 66.7,95.66 RYS22.P$1
PA_10
  Top 0.254: J10.P$23 65.4,89.64 RYS62.P$1
VDD  (via drill 0.35)  (2 unrouted)
  Top 0.508: R1.P$1 R2.P$1 R3.P$1 R4.P$1 R5.P$1 R6.P$1 R7.P$1 R8.P$1 19.55,15.05 v19.6,15 | 82.3,31.05 R14.P$1 | R14.P$1 R15.P$1 R16.P$1 R17.P$1 R9.P$1 R10.P$1 R11.P$1 R12.P$1 | R14.P$1 82.36,29.75 v82.3,29.7 | R23.P$2 v30.4,106.7 | R24.P$2 v33.7,106.7 | R25.P$2 v37,106.7 | R27.P$2 v40.4,106.7 | R29.P$2 v43.5,106.7 | R31.P$2 v46.8,106.7 | R33.P$2 v50.1,106.7 | R35.P$2 v53.4,106.7 | R37.P$2 v56.7,106.7 | 60.3,108.09 60.3,106.9 | R41.P$2 v63.7,106.7 | R43.P$2 v67,106.7 | R45.P$2 v70.2,106.7 | R47.P$2 v73.4,106.7 | R49.P$2 v76.7,106.7 | R51.P$2 v80,106.7 | R53.P$2 v83.5,106.7 | R55.P$2 v86.7,106.7 | R57.P$2 v90,106.7 | R59.P$2 v93.4,106.7 | R61.P$2 v28.5,78.65 | R63.P$2 v31.8,78.65 | R65.P$2 v35.3,78.65 | R67.P$2 v38.8,78.65 | R69.P$2 v42.2,78.65 | R71.P$2 v45.5,78.65 | R73.P$2 v48.8,78.65 | R75.P$2 v52,78.65 | R77.P$2 v55.1,78.65 | R79.P$2 v58.6,78.65 | R81.P$2 v61.9,78.65 | R83.P$2 v65.1,78.65 | R85.P$2 v68.2,78.65 | R87.P$2 v71.6,78.65 | R89.P$2 v74.9,78.65 | R91.P$2 v78.3,78.65 | R93.P$2 v81.5,78.65 | R95.P$2 v84.7,78.65 | R97.P$2 v88.1,78.65 | R99.P$2 v91.4,78.65 | R26.P$2 v28.3,67.6 | R28.P$2 v28.4,64.3 | R32.P$2 v28.5,61.2 | R36.P$2 v28.5,54.7 | R40.P$2 v28.5,58 | R30.P$2 v35.8,69.6 | R38.P$2 v35.9,66.3 | R44.P$2 v35.9,63.1 | R48.P$2 v36,59.8 | R52.P$2 v36.1,56.5 | R56.P$2 v57,67.5 | R60.P$2 v57,64.3 | R64.P$2 v57,61.3 | R68.P$2 v57.1,58.4 | R72.P$2 v57,55.3 | R76.P$2 v66.5,69.4 | R80.P$2 v66.6,66.3 | R84.P$2 v66.6,63.3 | R88.P$2 v66.6,60.2 | R92.P$2 v66.5,57.3 | SW4.2 SW4.1 61.3,31.07 61.3,25.2 | SW3.2 SW3.1 62.8,25.2 61.3,25.2 | SW2.2 SW2.1 61.3,19.07 | SW1.2 SW1.1 61.3,13.07 | v82.54,9.6 82.54,9.8 82.04,10.3 72.77,10.3 71.9,9.43 71.6,9.43 | 71.6,9.43 62.17,9.43 61.3,10.3 61.3,13.07 | 61.3,13.07 61.3,19.07
  Top 0.508: 61.3,19.07 61.3,25.2 | R13.P$2 71.32,9.15 71.6,9.43
  Top 2: J1.3 J1.4 v82.54,9.6
  Bottom 0.254: v66.6,66.3 66.5,66.2 | 66.4,63.1 v66.6,63.3
  Bottom 1.016: v82.54,9.6 82.54,29.46 v82.3,29.7
  other vias: 60.2,106.7
  pour Bottom (no thermals): 0,0 0,115 100,115 100,0
VDD5
  Bottom 1.27: J1.6 J1.5
VDD12
  Bottom 1.27: J1.8 J1.7